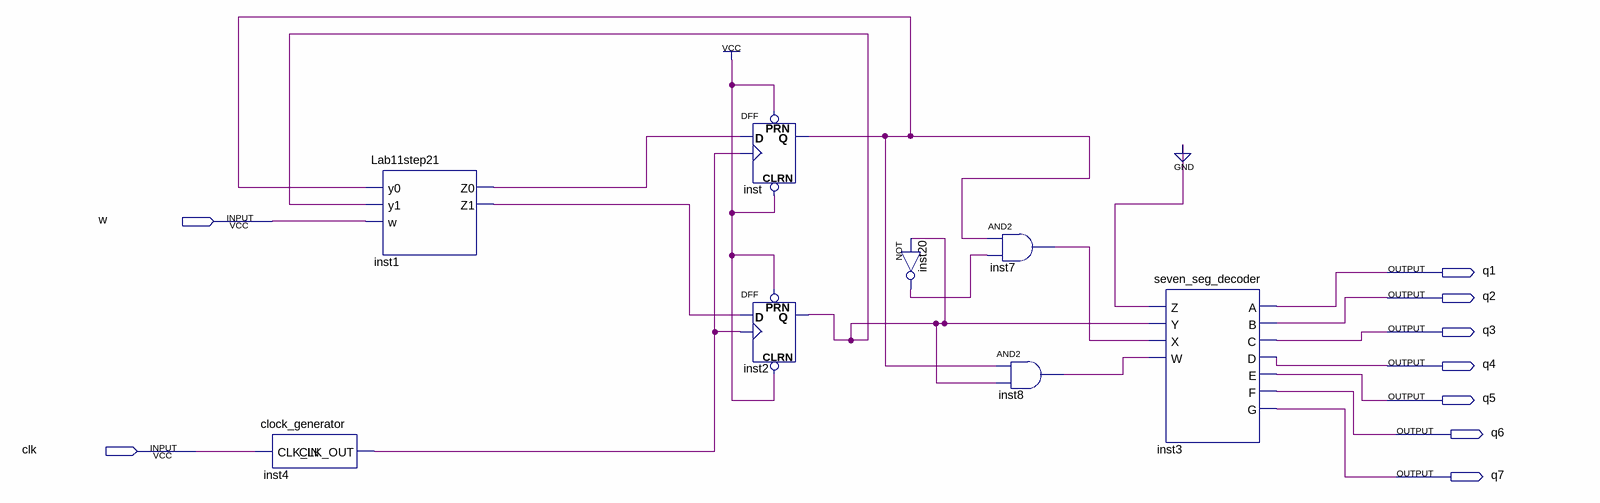
[diagram p0: schematic sheet]
// Quartus schematic Lab11step2.bdf as structural Verilog: 8 symbols, 9 pins
module Lab11step2 (
  input  w,
  input  clk,
  output q1,
  output q2,
  output q3,
  output q4,
  output q5,
  output q6,
  output q7
);

  wire inst1_z0, inst1_z1, inst2_q, inst4_clk_out, inst7_out, inst8_out, inst20_out, inst_q;

  clock_generator inst4 (.CLK_IN(clk), .CLK_OUT(inst4_clk_out));
  Lab11step21 inst1 (.y0(inst_q), .y1(inst2_q), .w(w), .Z0(inst1_z0), .Z1(inst1_z1));
  DFF inst (.CLRN(1'b1), .CLK(inst4_clk_out), .D(inst1_z0), .PRN(1'b1), .Q(inst_q));
  DFF inst2 (.CLRN(1'b1), .CLK(inst4_clk_out), .D(inst1_z1), .PRN(1'b1), .Q(inst2_q));
  not inst20 (inst20_out, inst2_q);
  and inst7 (inst7_out, inst_q, inst20_out);
  and inst8 (inst8_out, inst_q, inst2_q);
  seven_seg_decoder inst3 (
    .Z(1'b0), .Y(inst2_q), .X(inst7_out), .W(inst8_out), .A(q1), .B(q2), .C(q3), .D(q4), .E(q5), .F(q6),
    .G(q7));
endmodule
